# EAGLE design fsr_array (EAGLE 9.6.2)
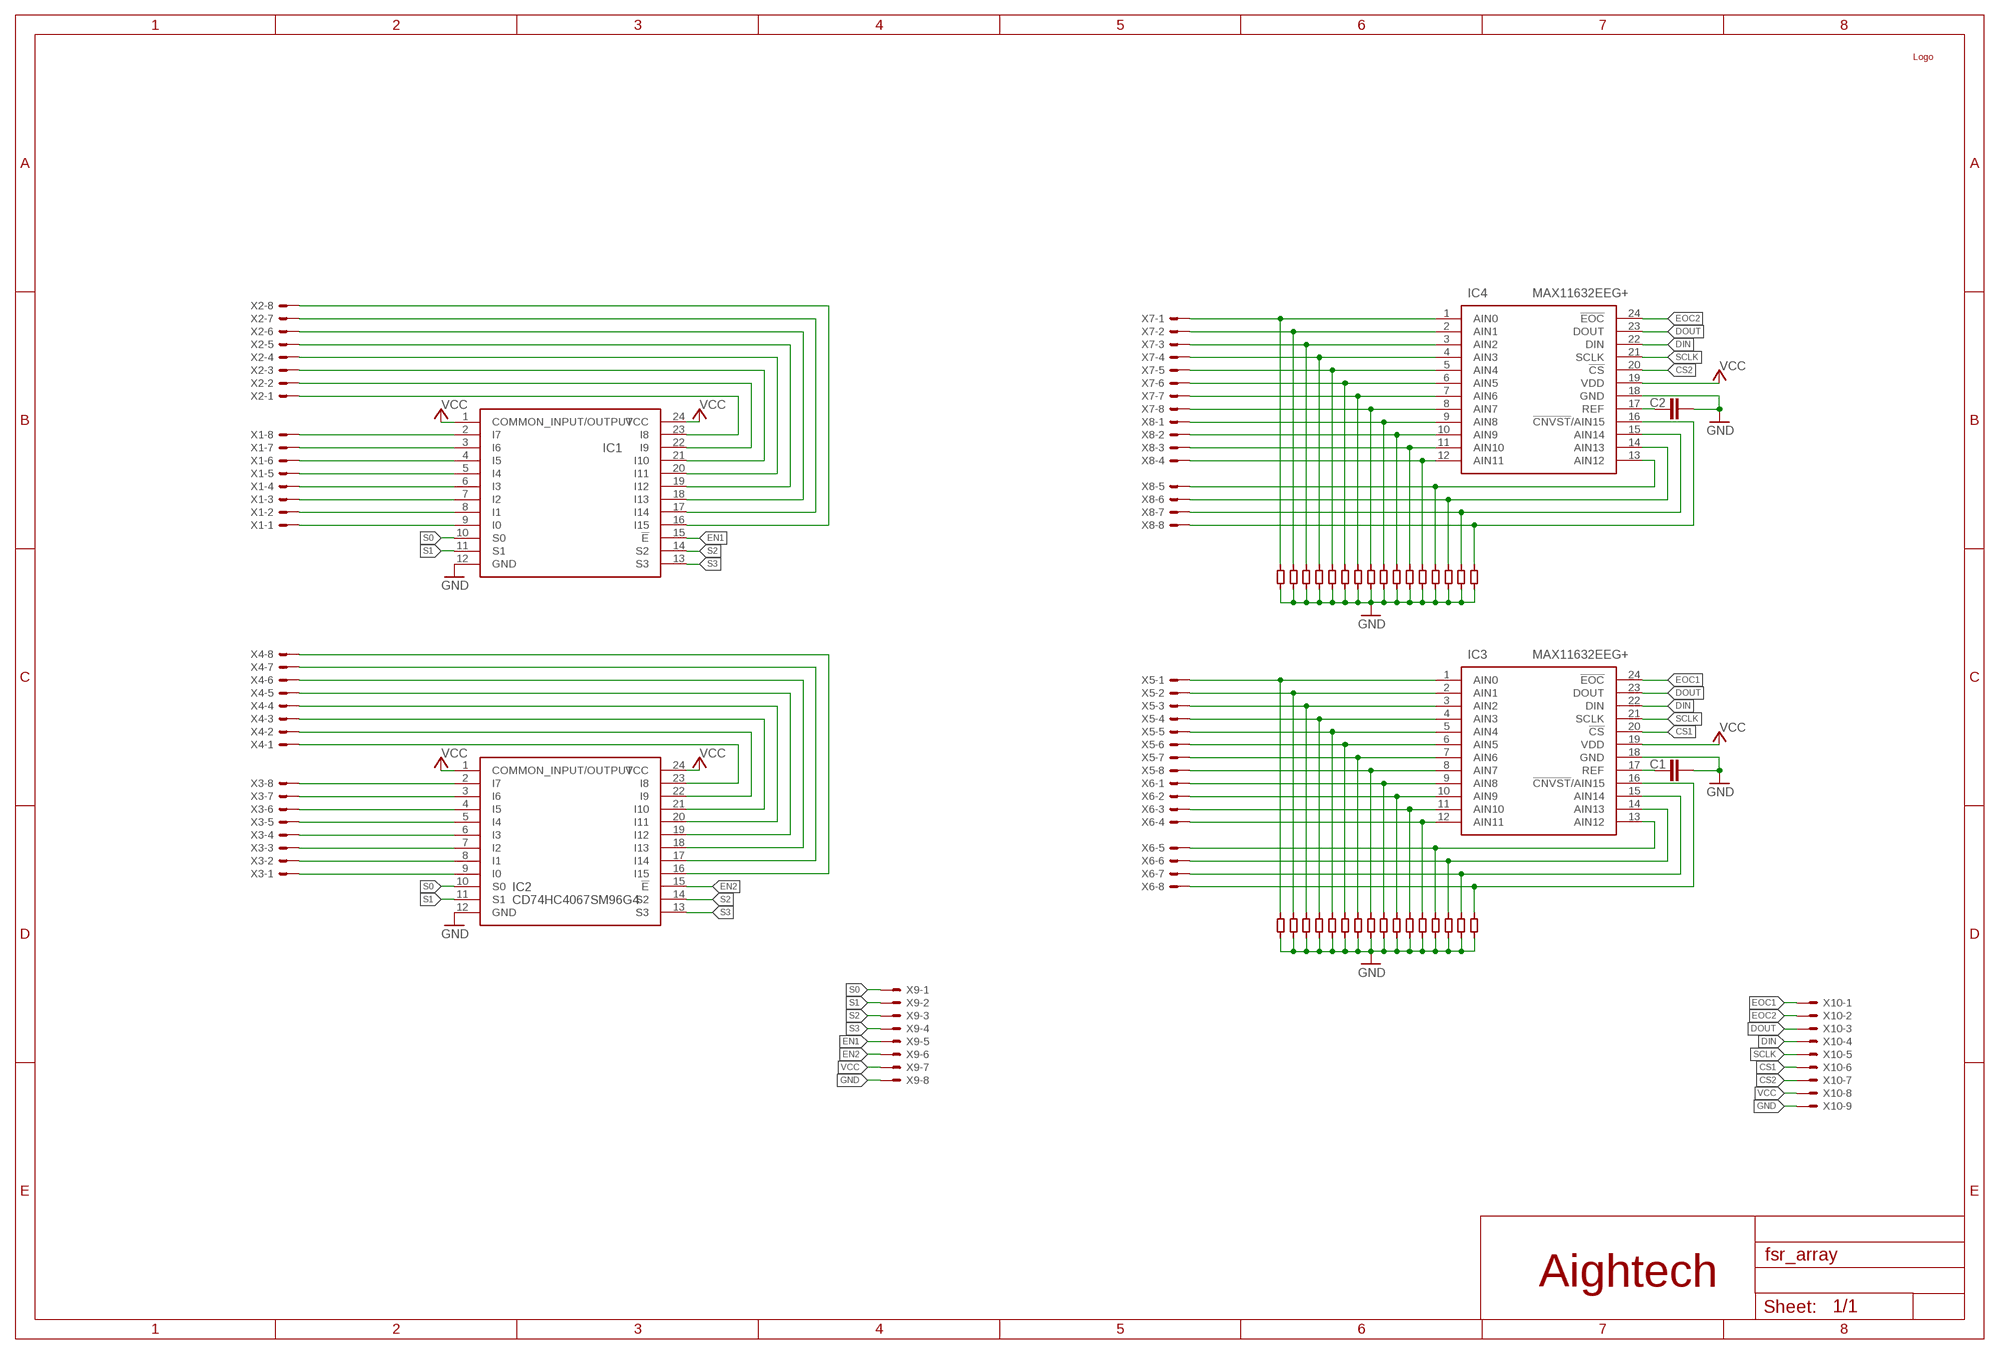
[diagram p0: schematic, sheet 1]

## Parts
C1  C-EUC0603  [C0603]
C2  C-EUC0603  [C0603]
CPLX1  LOGO  [LOGO]
IC1  CD74HC4067SM96G4  [SOP65P780X200-24N]
IC2  CD74HC4067SM96G4  [SOP65P780X200-24N]
IC3  MAX11632EEG+  [SOP64P602X175-24N]
IC4  MAX11632EEG+  [SOP64P602X175-24N]
U$1  HALF_RES  [HALP_RES]
U$2  HALF_RES  [HALP_RES]
U$3  HALF_RES  [HALP_RES]
U$4  HALF_RES  [HALP_RES]
U$5  HALF_RES  [HALP_RES]
U$6  HALF_RES  [HALP_RES]
U$7  HALF_RES  [HALP_RES]
U$8  HALF_RES  [HALP_RES]
U$9  HALF_RES  [HALP_RES]
U$10  HALF_RES  [HALP_RES]
U$11  HALF_RES  [HALP_RES]
U$12  HALF_RES  [HALP_RES]
U$13  HALF_RES  [HALP_RES]
U$14  HALF_RES  [HALP_RES]
U$15  HALF_RES  [HALP_RES]
U$16  HALF_RES  [HALP_RES]
U$17  HALF_RES  [HALP_RES]
U$18  HALF_RES  [HALP_RES]
U$19  HALF_RES  [HALP_RES]
U$20  HALF_RES  [HALP_RES]
U$21  HALF_RES  [HALP_RES]
U$22  HALF_RES  [HALP_RES]
U$23  HALF_RES  [HALP_RES]
U$24  HALF_RES  [HALP_RES]
U$25  HALF_RES  [HALP_RES]
U$26  HALF_RES  [HALP_RES]
U$27  HALF_RES  [HALP_RES]
U$28  HALF_RES  [HALP_RES]
U$29  HALF_RES  [HALP_RES]
U$30  HALF_RES  [HALP_RES]
U$31  HALF_RES  [HALP_RES]
U$32  HALF_RES  [HALP_RES]
U$33  HALF_RES  [HALP_RES]
U$34  HALF_RES  [HALP_RES]
U$35  HALF_RES  [HALP_RES]
U$36  HALF_RES  [HALP_RES]
U$37  HALF_RES  [HALP_RES]
U$38  HALF_RES  [HALP_RES]
U$39  HALF_RES  [HALP_RES]
U$40  HALF_RES  [HALP_RES]
U$41  HALF_RES  [HALP_RES]
U$42  HALF_RES  [HALP_RES]
U$43  HALF_RES  [HALP_RES]
U$44  HALF_RES  [HALP_RES]
U$45  HALF_RES  [HALP_RES]
U$46  HALF_RES  [HALP_RES]
U$47  HALF_RES  [HALP_RES]
U$48  HALF_RES  [HALP_RES]
U$49  HALF_RES  [HALP_RES]
U$50  HALF_RES  [HALP_RES]
U$51  HALF_RES  [HALP_RES]
U$52  HALF_RES  [HALP_RES]
U$53  HALF_RES  [HALP_RES]
U$54  HALF_RES  [HALP_RES]
U$55  HALF_RES  [HALP_RES]
U$56  HALF_RES  [HALP_RES]
U$57  HALF_RES  [HALP_RES]
U$58  HALF_RES  [HALP_RES]
U$59  HALF_RES  [HALP_RES]
U$60  HALF_RES  [HALP_RES]
U$61  HALF_RES  [HALP_RES]
U$62  HALF_RES  [HALP_RES]
U$63  HALF_RES  [HALP_RES]
U$64  HALF_RES  [HALP_RES]
X1  22-23-2081  [22-23-2081]
X2  22-23-2081  [22-23-2081]
X3  22-23-2081  [22-23-2081]
X4  22-23-2081  [22-23-2081]
X5  22-23-2081  [22-23-2081]
X6  22-23-2081  [22-23-2081]
X7  22-23-2081  [22-23-2081]
X8  22-23-2081  [22-23-2081]
X9  22-23-2081  [22-23-2081]
X10  22-23-2091  [22-23-2091]

## Nets
CS1: IC3.20(!CS) X10.6
CS2: IC4.20(!CS) X10.7
DIN: IC3.22(DIN) IC4.22(DIN) X10.4
DOUT: IC3.23(DOUT) IC4.23(DOUT) X10.3
EN1: IC1.15(!E) X9.5
EN2: IC2.15(!E) X9.6
EOC1: IC3.24(!EOC) X10.1
EOC2: IC4.24(!EOC) X10.2
GND: C1.2 C2.2 IC1.12(GND) IC2.12(GND) IC3.18(GND) IC4.18(GND) U$1.P$1 U$3.P$1 U$5.P$1 U$7.P$1 U$9.P$1 U$11.P$1 U$13.P$1 U$15.P$1 U$17.P$1 U$19.P$1 U$21.P$1 U$23.P$1 U$25.P$1 U$27.P$1 U$29.P$1 U$31.P$1 U$33.P$1 U$35.P$1 U$37.P$1 U$39.P$1 U$41.P$1 U$43.P$1 U$45.P$1 U$47.P$1 U$49.P$1 U$51.P$1 U$53.P$1 U$55.P$1 U$57.P$1 U$59.P$1 U$61.P$1 U$63.P$1 X9.8 X10.9
N$1: IC1.9(I0) X1.1
N$2: IC1.8(I1) X1.2
N$3: IC1.7(I2) X1.3
N$4: IC1.6(I3) X1.4
N$5: IC1.5(I4) X1.5
N$6: IC1.4(I5) X1.6
N$7: IC1.3(I6) X1.7
N$8: IC1.2(I7) X1.8
N$9: IC1.23(I8) X2.1
N$10: IC1.22(I9) X2.2
N$11: IC1.21(I10) X2.3
N$12: IC1.20(I11) X2.4
N$13: IC1.19(I12) X2.5
N$14: IC1.18(I13) X2.6
N$15: IC1.17(I14) X2.7
N$16: IC1.16(I15) X2.8
N$17: IC2.9(I0) X3.1
N$18: IC2.8(I1) X3.2
N$19: IC2.7(I2) X3.3
N$20: IC2.6(I3) X3.4
N$21: IC2.5(I4) X3.5
N$22: IC2.4(I5) X3.6
N$23: IC2.3(I6) X3.7
N$24: IC2.2(I7) X3.8
N$25: IC2.23(I8) X4.1
N$26: IC2.22(I9) X4.2
N$27: IC2.21(I10) X4.3
N$28: IC2.20(I11) X4.4
N$29: IC2.19(I12) X4.5
N$30: IC2.18(I13) X4.6
N$31: IC2.17(I14) X4.7
N$32: IC2.16(I15) X4.8
N$33: IC3.1(AIN0) U$16.P$1 X5.1
N$34: IC3.2(AIN1) U$14.P$1 X5.2
N$35: IC3.3(AIN2) U$12.P$1 X5.3
N$36: IC3.4(AIN3) U$10.P$1 X5.4
N$37: IC3.5(AIN4) U$8.P$1 X5.5
N$38: IC3.6(AIN5) U$6.P$1 X5.6
N$39: IC3.7(AIN6) U$4.P$1 X5.7
N$40: IC3.8(AIN7) U$2.P$1 X5.8
N$41: IC3.9(AIN8) U$32.P$1 X6.1
N$42: IC3.10(AIN9) U$30.P$1 X6.2
N$43: IC3.11(AIN10) U$28.P$1 X6.3
N$44: IC3.12(AIN11) U$26.P$1 X6.4
N$45: IC3.13(AIN12) U$24.P$1 X6.5
N$46: IC3.14(AIN13) U$22.P$1 X6.6
N$47: IC3.15(AIN14) U$20.P$1 X6.7
N$48: IC3.16(!CNVST!/AIN15) U$18.P$1 X6.8
N$49: IC4.1(AIN0) U$48.P$1 X7.1
N$50: IC4.2(AIN1) U$46.P$1 X7.2
N$51: IC4.3(AIN2) U$44.P$1 X7.3
N$52: IC4.4(AIN3) U$42.P$1 X7.4
N$53: IC4.5(AIN4) U$40.P$1 X7.5
N$54: IC4.6(AIN5) U$38.P$1 X7.6
N$55: IC4.7(AIN6) U$36.P$1 X7.7
N$56: IC4.8(AIN7) U$34.P$1 X7.8
N$57: IC4.9(AIN8) U$64.P$1 X8.1
N$58: IC4.10(AIN9) U$62.P$1 X8.2
N$59: IC4.11(AIN10) U$60.P$1 X8.3
N$60: IC4.12(AIN11) U$58.P$1 X8.4
N$61: IC4.13(AIN12) U$56.P$1 X8.5
N$62: IC4.14(AIN13) U$54.P$1 X8.6
N$63: IC4.15(AIN14) U$52.P$1 X8.7
N$64: IC4.16(!CNVST!/AIN15) U$50.P$1 X8.8
N$65: C1.1 IC3.17(REF)
N$66: C2.1 IC4.17(REF)
S0: IC1.10(S0) IC2.10(S0) X9.1
S1: IC1.11(S1) IC2.11(S1) X9.2
S2: IC1.14(S2) IC2.14(S2) X9.3
S3: IC1.13(S3) IC2.13(S3) X9.4
SCLK: IC3.21(SCLK) IC4.21(SCLK) X10.5
VCC: IC1.1(COMMON_INPUT/OUTPUT) IC1.24(VCC) IC2.1(COMMON_INPUT/OUTPUT) IC2.24(VCC) IC3.19(VDD) IC4.19(VDD) X9.7 X10.8

## Notes on the sheet
- Aightech

## Library data of the parts
C1 C2 = rcl:C-EU: CAPACITOR, European symbol; SPICEPREFIX: C
CPLX1 = AAA_persoLib:LOGO
IC1 IC2 = SamacSys_Parts:CD74HC4067SM96G4: Multiplexer Switch ICs Hi Sp CMOS 16-Ch Ana Multipl/Demult Source: Datasheet <http://www.ti.com/general/docs/lit/getliterature.tsp?genericPartNumber=CD74HC4067&&fileType=pdf>; DESCRIPTION: Multiplexer Switch ICs Hi Sp CMOS 16-Ch Ana Multipl/Demult; HEIGHT: 2mm; MANUFACTURER_NAME: Texas Instruments; MANUFACTURER_PART_NUMBER: CD74HC4067SM96G4
IC3 IC4 = SamacSys_Parts:MAX11632EEG+: 12-Bit, 300ksps ADCs with FIFO and Internal Reference Source: Datasheet <http://china.rs-online.com/web/p/products/1916838>; DESCRIPTION: 12-Bit, 300ksps ADCs with FIFO and Internal Reference; HEIGHT: 1.75mm; MANUFACTURER_NAME: Maxim Integrated; MANUFACTURER_PART_NUMBER: MAX11632EEG+; RS_PART_NUMBER: 1916838; RS_PRICE-STOCK: http://china.rs-online.com/web/p/products/1916838
U$1-U$64 = 1persoLib:HALF_RES
X1-X9 = con-molex:22-23-2081: .100" (2.54mm) Center Header - 8 Pin; MF: MOLEX; MPN: 22-23-2081; OC_FARNELL: 1756826; OC_NEWARK: 01C7592
X10 = con-molex:22-23-2091: .100" (2.54mm) Center Header - 9 Pin; MF: MOLEX; MPN: 22-23-2091; OC_FARNELL: 1756827; OC_NEWARK: 56H0450

## Board
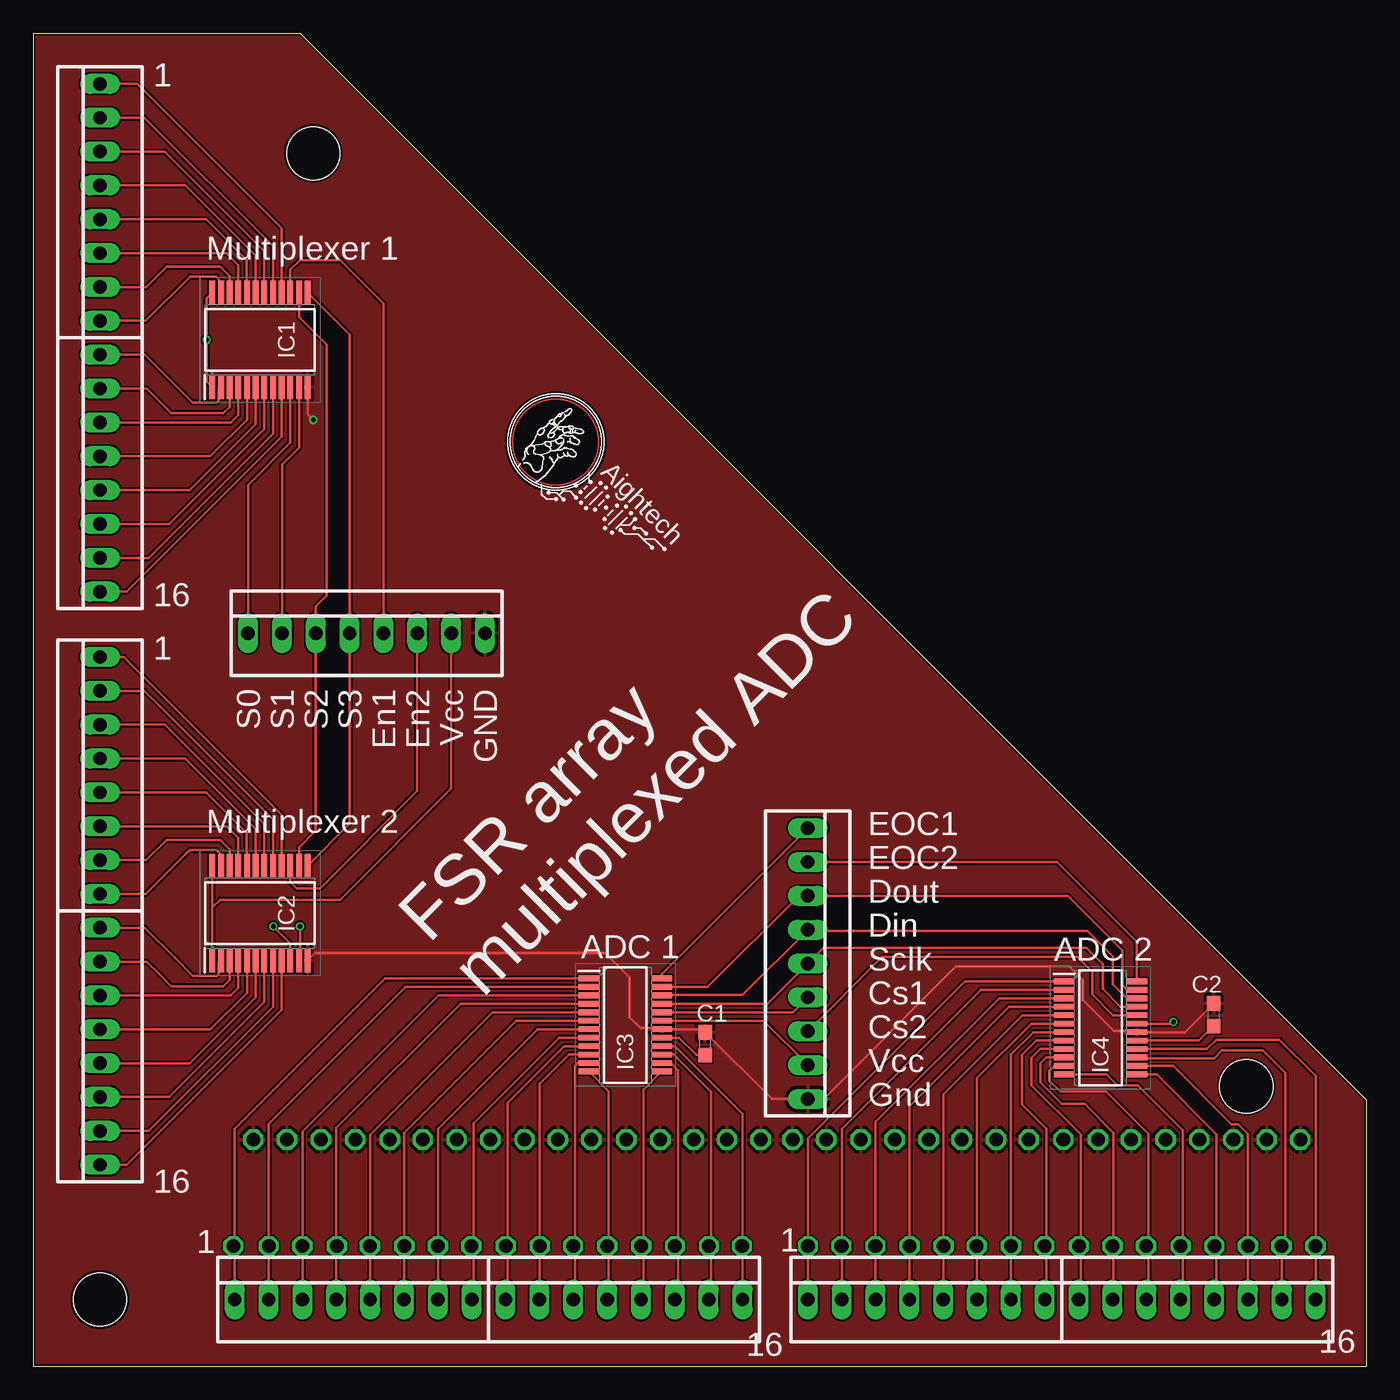
[diagram p1: board, top side]
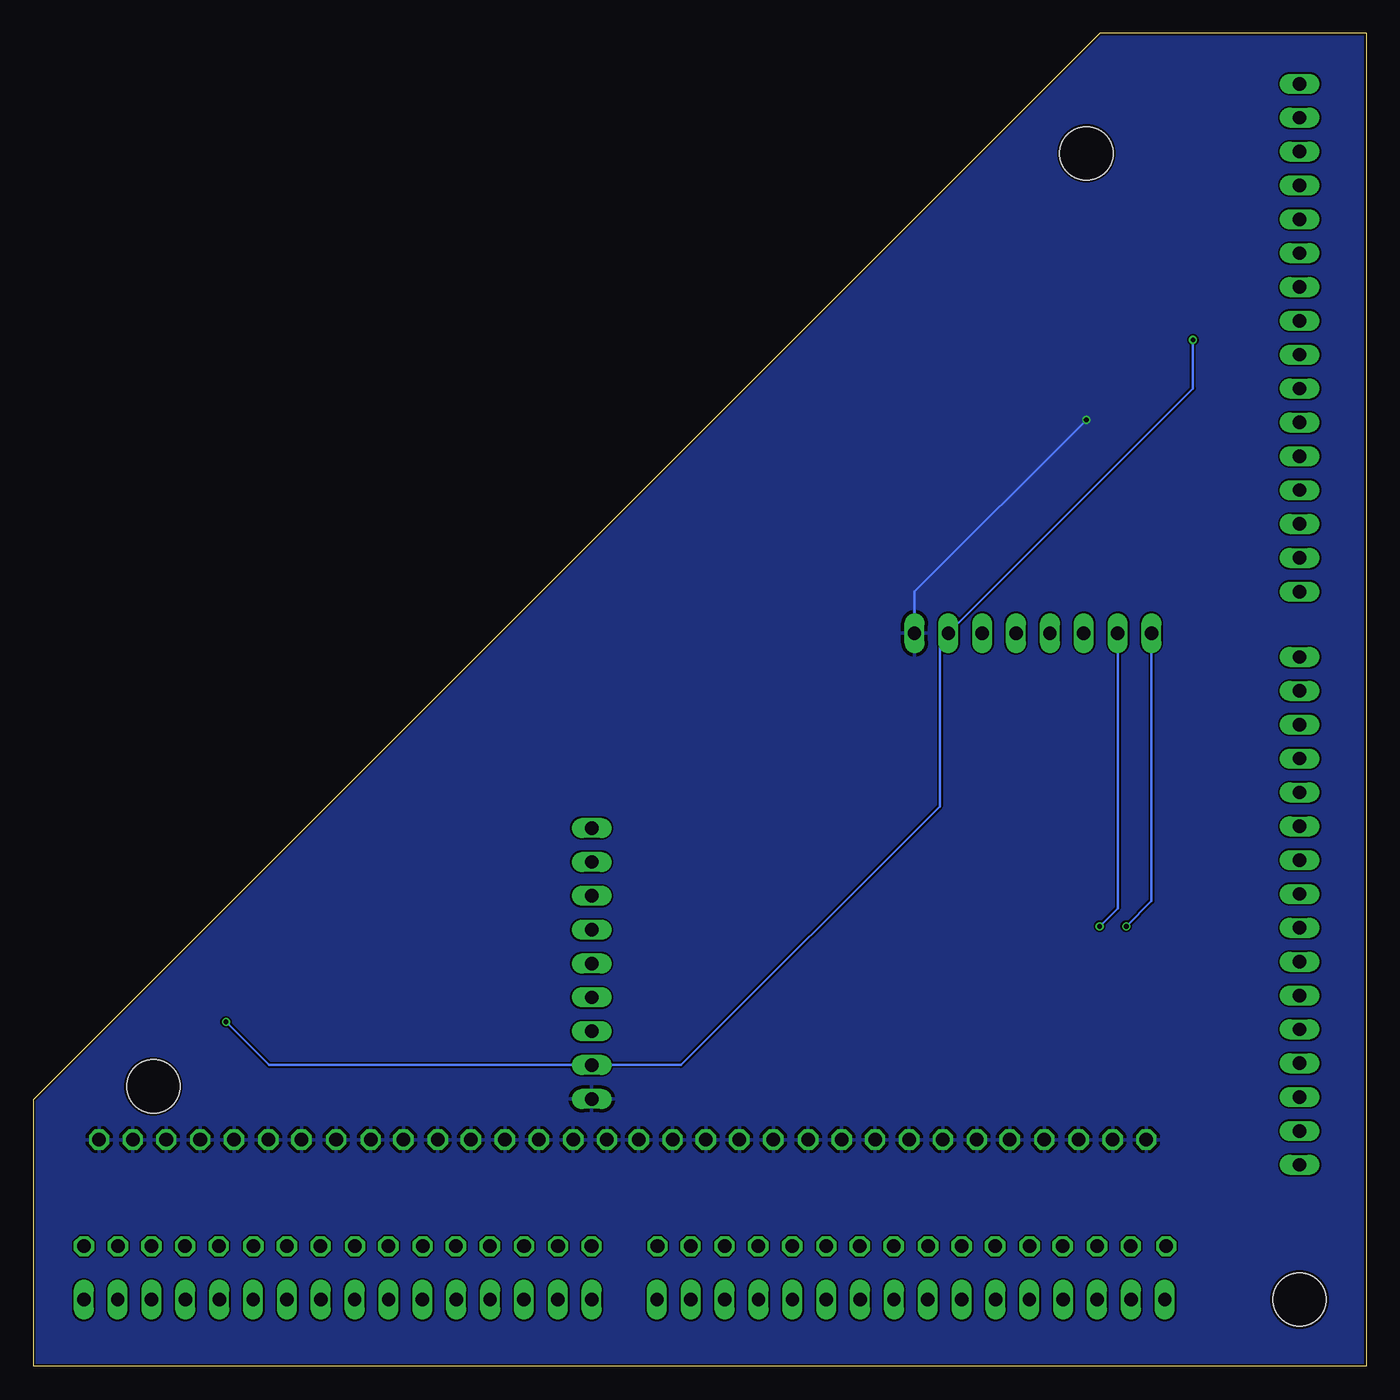
[diagram p2: board, bottom side, seen from below]

Size 100 x 100 mm. Coordinates in mm from the lower left corner, seen from the top.
Outline: 0,0 100,0 100,20 20,100 0,100 0,0
Copper layers (1*16): Top 0.035mm / dielectric 1.5mm / Bottom 0.035mm
Design rules "SparkFun-2-Layer-Minimum-JLCPCB": minimum track width 5mil, minimum drill 0.3mm, track to track 5mil, track to pad 5mil, pad to pad 5mil, via to via 5mil, smd to smd 5mil, copper to edge 7mil, drill to drill 7mil, minimum pad ring 5mil, minimum via ring 5mil, stop-mask expansion 2.5mil, vias tented up to drill 25mil, thermal gap 10mil
Holes 4 mm at 5,5 21,91 91,21

### Footprints (pad centres in the part's own frame; a part is rotated, then mirrored left to right if it is on the bottom)
C0603 = smd 1.1 x 1: 1 -0.85,0; 2 0.85,0
SOP65P780X200-24N = smd 1.8 x 0.45: 1 -3.55,3.575; 2 -3.55,2.925; 3 -3.55,2.275; 4 -3.55,1.625; 5 -3.55,0.975; 6 -3.55,0.325; 7 -3.55,-0.325; 8 -3.55,-0.975; 9 -3.55,-1.625; 10 -3.55,-2.275; 11 -3.55,-2.925; 12 -3.55,-3.575; 13 3.55,-3.575; 14 3.55,-2.925; 15 3.55,-2.275; 16 3.55,-1.625; 17 3.55,-0.975; 18 3.55,-0.325; 19 3.55,0.325; 20 3.55,0.975; 21 3.55,1.625; 22 3.55,2.275; 23 3.55,2.925; 24 3.55,3.575
SOP64P602X175-24N = smd 1.55 x 0.435: 1 -2.725,3.492; 2 -2.725,2.858; 3 -2.725,2.222; 4 -2.725,1.588; 5 -2.725,0.952; 6 -2.725,0.318; 7 -2.725,-0.318; 8 -2.725,-0.952; 9 -2.725,-1.588; 10 -2.725,-2.222; 11 -2.725,-2.858; 12 -2.725,-3.492; 13 2.725,-3.492; 14 2.725,-2.858; 15 2.725,-2.222; 16 2.725,-1.588; 17 2.725,-0.952; 18 2.725,-0.318; 19 2.725,0.318; 20 2.725,0.952; 21 2.725,1.588; 22 2.725,2.222; 23 2.725,2.858; 24 2.725,3.492
HALP_RES = drill 1.016 pad 1.524 octagon: P$1 0,0
22-23-2081 = drill 1 long: 1 -8.89,0; 2 -6.35,0; 3 -3.81,0; 4 -1.27,0; 5 1.27,0; 6 3.81,0; 7 6.35,0; 8 8.89,0
22-23-2091 = drill 1 long: 1 -10.16,0; 2 -7.62,0; 3 -5.08,0; 4 -2.54,0; 5 0,0; 6 2.54,0; 7 5.08,0; 8 7.62,0; 9 10.16,0

### Placement (x,y rotation side)
C1  50.4,24.2 90 top
C2  88.55,26.37 90 top
CPLX1  39.77,73.55 315 top
IC1  17,77 90 top
IC2  17,34 90 top
IC3  44.42,25.6 0 top
IC4  80.07,25.38 0 top
U$1  47.03,17 90 top
U$2  32.86,9 270 top
U$3  24.15,17 90 top
U$4  30.34,9 270 top
U$5  49.54,17 90 top
U$6  27.84,9 270 top
U$7  26.74,17 90 top
U$8  25.26,9 270 top
U$9  52.04,17 90 top
U$10  22.77,9 270 top
U$11  29.21,17 90 top
U$12  20.19,9 270 top
U$13  54.58,17 90 top
U$14  17.66,9 270 top
U$15  31.76,17 90 top
U$16  15,9 270 top
U$17  21.58,17 270 top
U$18  53.17,9 270 top
U$19  34.29,17 90 top
U$20  50.69,9 270 top
U$21  19.02,17 270 top
U$22  48.14,9 270 top
U$23  36.85,17 90 top
U$24  45.62,9 270 top
U$25  16.5,17 270 top
U$26  43.06,9 270 top
U$27  39.36,17 90 top
U$28  40.5,9 270 top
U$29  56.96,17 90 top
U$30  38,9 270 top
U$31  41.87,17 90 top
U$32  35.46,9 270 top
U$33  59.49,17 90 top
U$34  75.86,9 270 top
U$35  44.48,17 90 top
U$36  73.36,9 270 top
U$37  90.03,17 90 top
U$38  70.79,9 270 top
U$39  64.62,17 90 top
U$40  68.31,9 270 top
U$41  92.54,17 90 top
U$42  65.76,9 90 top
U$43  62.08,17 90 top
U$44  63.18,9 270 top
U$45  79.88,17 90 top
U$46  60.63,9 270 top
U$47  87.48,17 90 top
U$48  58.12,9 270 top
U$49  77.28,17 90 top
U$50  96.19,9 270 top
U$51  82.37,17 90 top
U$52  93.66,9 90 top
U$53  67.17,17 90 top
U$54  91.14,9 270 top
U$55  74.69,17 90 top
U$56  88.61,9 270 top
U$57  84.94,17 90 top
U$58  86.09,9 270 top
U$59  72.23,17 90 top
U$60  83.49,9 270 top
U$61  95.06,17 90 top
U$62  80.97,9 90 top
U$63  69.65,17 90 top
U$64  78.45,9 270 top
X1  5,67 90 top
X2  5,87.32 90 top
X3  5,24 90 top
X4  5,44.32 90 top
X5  24,5 0 top
X6  44.32,5 0 top
X7  67,5 0 top
X8  87.32,5 0 top
X9  25,55 0 top
X10  58.11,30.21 270 top

### Tracks (layer width: path | path; a pad name or v marks a point on that pad's centre or on a via)
CS1
  Top 0.2: X10.6 56.99,26.55 IC3.20
CS2
  Top 0.2: IC4.20 81.01,26.33 79.44,27.9 79.44,29.59 78.33,30.7 63.68,30.7 X10.7
DIN
  Top 0.2: IC3.22 47.16,27.84 53.2,27.84 X10.4 58.21,32.65 79.08,32.65 81,30.73 81,28.64 82.04,27.6 IC4.22
DOUT
  Top 0.2: IC3.23 50.6,28.46 57.43,35.29 X10.3 77.6,35.29 81.7,31.19 81.7,28.6 82.06,28.24 IC4.23
EN1
  Top 0.2: IC1.15 19.27,82.28 20,83 23,83 26.27,79.73 X9.5
EN2
  Top 0.2: IC2.15 19.27,36.33 19.75,35.85 21.5,35.85 28.81,43.16 X9.6
EOC1
  Top 0.2: X10.1 47.15,29.41 IC3.24
EOC2
  Top 0.2: X10.2 76.79,37.83 82.8,31.82 IC4.24
GND  (via drill 0.35)
  Top 0.2: C2.2 86.39,25.06 IC4.18 82.69,25.17 81.08,25.17 78.76,27.49 78.76,28.97 77.75,29.98 69.23,29.98 59.3,20.05 X10.9 55.4,20.05 C1.2 50.17,25.28 IC3.18 47.05,25.38 45.55,25.38 44.74,26.18 44.74,29.16 42.9,31 21.12,31 IC2.12 | IC1.12 20.57,71.42 v21,71
  Bottom 0.2: v21,71 33.89,58.11 X9.8
  pour Top: -9.71,-9.29 -9.71,110 110,110 110,-9.29
  pour Bottom: -19.71,120 120,120 120,-16.57 -19.71,-16.57
N$1
  Top 0.2: IC1.9 18.62,69.73 7,58.11 X1.1
N$2
  Top 0.2: IC1.8 17.98,69.97 8.65,60.65 X1.2
N$3
  Top 0.2: IC1.7 17.32,70.33 10.19,63.19 X1.3
N$4
  Top 0.2: IC1.6 16.68,70.67 11.73,65.73 X1.4
N$5
  Top 0.2: IC1.5 16.02,71.03 13.27,68.27 X1.5
N$6
  Top 0.2: IC1.4 15.38,71.38 14.81,70.81 X1.6
N$7
  Top 0.2: IC1.3 14.72,71.97 14.25,71.5 10.35,71.5 8.5,73.35 X1.7
N$8
  Top 0.2: IC1.2 13.9,73.28 13.9,72.44 13.76,72.3 11.95,72.3 8.36,75.89 X1.8
N$9
  Top 0.2: IC1.23 14.07,81.38 13.71,81.75 11.75,81.75 8.43,78.43 X2.1
N$10
  Top 0.2: IC1.22 14.72,81.78 14,82.5 10,82.5 8.47,80.97 X2.2
N$11
  Top 0.2: IC1.21 15.38,82.62 14.5,83.5 14.49,83.51 X2.3
N$12
  Top 0.2: IC1.20 16,80.58 16,83 12.95,86.05 X2.4
N$13
  Top 0.2: IC1.19 16.68,83.33 11.41,88.59 X2.5
N$14
  Top 0.2: IC1.18 17.32,83.67 9.87,91.13 X2.6
N$15
  Top 0.2: IC1.17 17.98,84.03 8.33,93.67 X2.7
N$16
  Top 0.2: IC1.16 18.62,84 18.62,84.38 18.62,85.38 7.79,96.21 X2.8
N$17
  Top 0.2: IC2.9 18.62,26.73 7,15.11 X3.1
N$18
  Top 0.2: IC2.8 17.98,26.98 8.65,17.65 X3.2
N$19
  Top 0.2: IC2.7 17.32,27.32 10.19,20.19 X3.3
N$20
  Top 0.2: IC2.6 16.68,27.68 11.73,22.73 X3.4
N$21
  Top 0.2: IC2.5 16.02,28.02 13.27,25.27 X3.5
N$22
  Top 0.2: IC2.4 15.38,28.38 14.81,27.81 X3.6
N$23
  Top 0.2: IC2.3 14.72,28.98 14.25,28.5 10.35,28.5 9.43,29.43 8.5,30.35 X3.7
N$24
  Top 0.2: IC2.2 13.9,30.28 13.9,29.45 13.76,29.3 11.95,29.3 10.62,30.62 8.36,32.89 X3.8
N$25
  Top 0.2: IC2.23 14.07,38.38 13.71,38.75 11.75,38.75 11.5,38.5 8.43,35.43 X4.1
N$26
  Top 0.2: IC2.22 14.72,38.77 14,39.5 10,39.5 8.47,37.97 X4.2
N$27
  Top 0.2: IC2.21 15.38,39.62 14.49,40.51 X4.3
N$28
  Top 0.2: IC2.20 16,37.58 16,40 13,43 12.95,43.05 X4.4
N$29
  Top 0.2: IC2.19 16.68,40.33 11.41,45.59 X4.5
N$30
  Top 0.2: IC2.18 17.32,40.67 9.87,48.13 X4.6
N$31
  Top 0.2: IC2.17 17.98,41.02 9.5,49.5 8.33,50.67 X4.7
N$32
  Top 0.2: IC2.16 18.62,41.38 6.79,53.21 X4.8
N$33
  Top 0.152: U$16.P$1 15.11,9
  Top 0.2: X5.1 15.11,9 15.11,17.82 26.38,29.09 IC3.1
N$34
  Top 0.152: U$14.P$1 17.65,8.93
  Top 0.2: IC3.2 27.92,28.46 17.65,18.19 17.65,8.93 X5.2
N$35
  Top 0.152: U$12.P$1
  Top 0.2: IC3.3 30.39,27.82 20.19,17.62 U$12.P$1 X5.3
N$36
  Top 0.152: U$10.P$1 22.73,9
  Top 0.2: IC3.4 32.05,27.19 22.73,17.87 22.73,9 X5.4
N$37
  Top 0.152: U$8.P$1
  Top 0.2: X5.5 U$8.P$1 25.27,17.35 34.47,26.55 IC3.5
N$38
  Top 0.152: U$6.P$1 27.81,9
  Top 0.2: X5.6 27.81,9 27.81,17.51 36.22,25.92 IC3.6
N$39
  Top 0.152: U$4.P$1
  Top 0.2: X5.7 U$4.P$1 30.35,17.81 37.82,25.28 IC3.7
N$40
  Top 0.152: U$2.P$1 33.02,9
  Top 0.2: X5.8 33.02,5.13 33.02,9 33.02,18.22 39.45,24.65 IC3.8
N$41
  Top 0.152: U$32.P$1 35.57,9
  Top 0.2: X6.1 35.57,5.14 35.57,9 35.57,19.77 39.81,24.01 IC3.9
N$42
  Top 0.152: U$30.P$1 37.97,8.99
  Top 0.2: X6.2 37.97,8.99 37.97,21.17 40.18,23.38 IC3.10
N$43
  Top 0.152: U$28.P$1 40.64,9
  Top 0.2: IC3.11 40.84,22.74 40.64,22.54 40.64,9 40.64,5.13 X6.3
N$44
  Top 0.152: U$26.P$1 43.16,9 43.17,9.01
  Top 0.2: IC3.12 43.17,20.63 43.17,9.01 43.17,5.12 X6.4
N$45
  Top 0.152: U$24.P$1 45.75,9 45.78,9.03
  Top 0.2: IC3.13 45.78,20.74 45.78,9.03 45.78,5.19 X6.5
N$46
  Top 0.152: U$22.P$1 48.35,9 48.38,9.03
  Top 0.2: IC3.14 47.84,22.74 48.38,22.21 48.38,9.03 48.38,5.25 X6.6
N$47
  Top 0.152: U$20.P$1 50.84,9 50.84,9.01
  Top 0.2: IC3.15 48.05,23.38 50.84,20.58 50.84,9.01 50.84,5.17 X6.7
N$48
  Top 0.152: U$18.P$1 53.19,9 53.21,9.02
  Top 0.2: IC3.16 48.15,24.01 53.21,18.95 53.21,9.02 X6.8
N$49
  Top 0.152: U$48.P$1
  Top 0.2: X7.1 U$48.P$1 58.11,17.08 69.9,28.87 IC4.1
N$50
  Top 0.152: U$46.P$1 60.65,9.01
  Top 0.2: X7.2 60.65,9.01 60.65,17.81 71.08,28.24 IC4.2
N$51
  Top 0.152: U$44.P$1
  Top 0.2: X7.3 U$44.P$1 63.19,18.33 72.47,27.6 IC4.3
N$52
  Top 0.152: U$42.P$1 65.73,8.99
  Top 0.2: X7.4 65.73,8.99 65.73,19.5 73.2,26.97 IC4.4
N$53
  Top 0.152: U$40.P$1 68.27,8.99
  Top 0.2: X7.5 68.27,8.99 68.27,20.4 74.2,26.33 IC4.5
N$54
  Top 0.152: U$38.P$1 70.81,9.01
  Top 0.2: X7.6 70.81,9.01 70.81,21.62 74.89,25.7 IC4.6
N$55
  Top 0.152: U$36.P$1
  Top 0.2: X7.7 U$36.P$1 73.35,23.39 75.02,25.06 IC4.7
N$56
  Top 0.152: U$34.P$1 76,9 76.01,8.99
  Top 0.2: X7.8 76.01,5.12 76.01,8.99 76.01,17.79 74.17,19.63 74.17,23.35 75.25,24.43 IC4.8
N$57
  Top 0.152: U$64.P$1 78.56,9 78.58,8.98
  Top 0.2: IC4.9 75.56,23.79 74.89,23.12 74.89,21.07 78.58,17.39 78.58,8.98 78.58,5.15 X8.1
N$58
  Top 0.152: U$62.P$1 81.01,9 81.03,8.98
  Top 0.2: IC4.10 76,23.16 75.55,22.71 75.55,21.3 77.17,19.67 78.88,19.67 81.03,17.52 81.03,8.98 81.03,5.06 X8.2
N$59
  Top 0.152: U$60.P$1 83.67,9
  Top 0.2: IC4.11 76.61,22.52 76.23,22.15 76.23,21.43 77.05,20.61 80.48,20.61 83.67,17.42 83.67,9 83.67,5.16 X8.3
N$60
  Top 0.152: U$58.P$1 86.21,9 86.23,9.02
  Top 0.2: IC4.12 80.5,21.89 81.33,21.07 82.86,21.07 86.23,17.69 86.23,9.02 86.23,5.18 X8.4
N$61
  Top 0.152: U$56.P$1 88.76,9 88.77,9.01
  Top 0.2: IC4.13 84.28,21.89 88.77,17.39 88.77,9.01 88.77,5.18 X8.5
N$62
  Top 0.152: U$54.P$1
  Top 0.2: IC4.14 85.52,22.52 89.89,18.15 90.41,18.15 91.13,17.43 U$54.P$1 X8.6
N$63
  Top 0.152: U$52.P$1 93.92,9
  Top 0.2: IC4.15 82.84,23.11 88.59,23.11 89.17,23.69 92.24,23.69 93.92,22.01 93.92,9 | U$52.P$1 X8.7
N$64
  Top 0.152: U$50.P$1 96.21,9
  Top 0.2: IC4.16 88.03,23.79 88.74,24.5 93.5,24.5 96.21,21.79 96.21,9 X8.8
N$65
  Top 0.2: IC3.17 48.45,24.65 49.74,23.35 C1.1
N$66
  Top 0.2: IC4.17 87.46,24.43 C2.1
S0  (via drill 0.35)
  Top 0.2: IC1.10 19.27,69.28 16.11,66.11 X9.1 | v18,33 19.27,31.73 IC2.10
  Bottom 0.2: X9.1 16.11,34.89 v18,33
S1  (via drill 0.35)
  Top 0.2: IC1.11 19.93,68.92 18.65,67.65 X9.2 | v20,33 20,30.52 IC2.11
  Bottom 0.2: X9.2 18.65,34.35 v20,33
S2
  Top 0.2: IC1.14 19.93,78.72 22,76.64 22,57.81 21.19,57 X9.3 21.19,40.19 19.93,38.92 IC2.14
S3
  Top 0.2: IC1.13 23.73,77.39 X9.4 23.73,40.7 IC2.13
SCLK
  Top 0.2: IC3.21 55.09,27.19 X10.5 59.27,31.37 78.99,31.37 80.23,30.13 80.23,28.29 81.55,26.97 IC4.21
VCC  (via drill 0.35)
  Top 0.2: X10.8 54.78,25.92 IC3.19 | X9.7 31.35,43.35 23,35 14,35 13.43,34.42 | 13.43,34.42 IC2.1 | IC2.24 13.43,34.42 | IC1.24 13,80.12 v13,77 13,73.88 IC1.1 | v85.54,25.83 85.54,25.7 IC4.19
  Bottom 0.2: v13,77 13,73.35 X9.7 32,54.35 32,42 51.41,22.59 X10.8 82.3,22.59 v85.54,25.83

### Text on the board
tPlace: 1 | Multiplexer 1 | 16 | 1 | S0 | S1 | S2 | S3 | En1 | En2 | Vcc | GND | Multiplexer 2 | EOC1 | EOC2 | Dout | Din | ADC 1 | Sclk | ADC 2 | FSR array / multiplexed ADC | Cs1 | Cs2 | Vcc | Gnd | 16 | 1 | 1 | 16 | 16